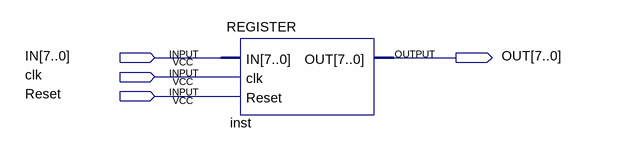
[diagram p0: schematic sheet]
// Quartus schematic MDR.bdf as structural Verilog: 1 symbols, 4 pins
module MDR (
  input  [7:0] IN,
  input  clk,
  input  Reset,
  output [7:0] OUT
);

  REGISTER inst (.IN(IN), .clk(clk), .Reset(Reset), .OUT(OUT));
endmodule
